# EAGLE design mw_ltb_full_v2.0.0 (EAGLE 6.4)
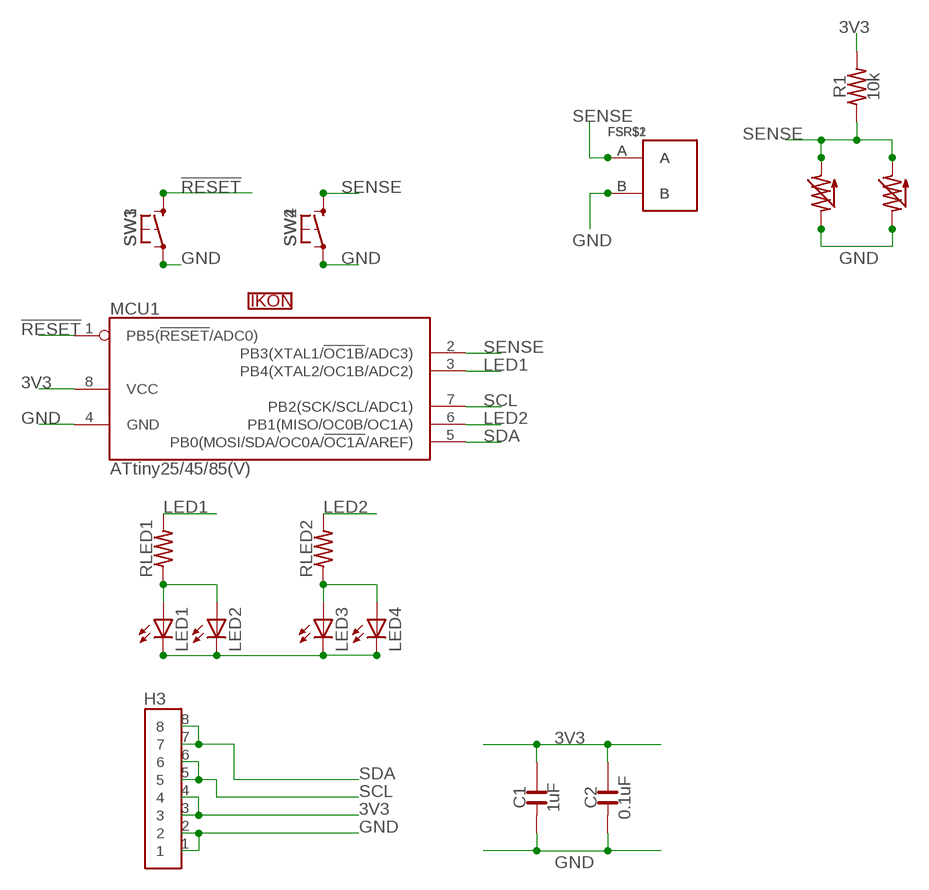
[diagram p0: schematic, sheet 1]

## Parts
C1  1uF  CAPACITOR-0603  [0603_YAGEO]
C2  0.1uF  CAPACITOR-0603  [0603_YAGEO]
FSR$1  FSR_PAD88X44_P2B  [FSR_PAD_88X44_P2B]
FSR$2  FSR_PAD88X44_P2B  [FSR_PAD_88X44_P2B]
H3  HEADER_8P-0.1"_2X4-SMD-SULLINS  [HEADER-0.1"_2X4-SMD-SULLINS]
LED1  LED-ZBEND_RM  [Z-BEND_RM]
LED2  LED-ZBEND_RM  [Z-BEND_RM]
LED3  LED-ZBEND_RM  [Z-BEND_RM]
LED4  LED-ZBEND_RM  [Z-BEND_RM]
MCU1  ATMEL_ATTINY25/45/85(V)-SOIC_DUAL  [SOIC-8_DUAL]
R1  10k  RESISTOR-0603  [0603_YAGEO]
RLED1  RESISTOR-0603  [0603_YAGEO]
RLED2  RESISTOR-0603  [0603_YAGEO]
SW1  SWITCH_SPST-KMT0  [SWITCH_KMT0]
SW2  SWITCH_SPST-KMT0  [SWITCH_KMT0]
SW3  SWITCH_SPST-TL3315  [SWITCH_TL3315]
SW4  SWITCH_SPST-TL3315  [SWITCH_TL3315]
U$1  FSR_PINS  FSR_PINSJUMBO_SMD  [FSR_0.1"-PITCH_PADS-0.05"X0.5"]
U$2  FSR_PLACE  FSR_PLACE1.5"SQR  [FSR_1.5[IN]_SQR]
U$3  FSR_PINS  FSR_PINSJUMBO_SMD  [FSR_0.1"-PITCH_PADS-0.05"X0.5"]
U$4  FSR_PLACE  FSR_PLACE1.5"SQR  [FSR_1.5[IN]_SQR]
U$5  FSR_PLACE  FSR_PLACE1.5"SQR  [FSR_1.5[IN]_SQR]
U$6  FSR_PLACE  FSR_PLACE1.5"SQR  [FSR_1.5[IN]_SQR]
U$9  FSR_PINS  FSR_PINSJUMBO_SMD  [FSR_0.1"-PITCH_PADS-0.05"X0.5"]
U$10  FSR_PINS  FSR_PINSJUMBO_SMD  [FSR_0.1"-PITCH_PADS-0.05"X0.5"]
U$11  IKONLEARNING-20MIL  [IKON_LEARNING_20MIL]

## Nets
3V3: C1.2 C2.2 H3.3 H3.4 MCU1.8(VCC) R1.2
!RESET: MCU1.1(PB5(!RESET!/ADC0)) SW1.1@1 SW1.1@2 SW3.1@1 SW3.1@2
GND: C1.1 C2.1 FSR$1.B FSR$2.B H3.1 H3.2 LED1.K(C) LED2.K(C) LED3.K(C) LED4.K(C) MCU1.4(GND) SW1.2@1 SW1.2@2 SW2.2@1 SW2.2@2 SW3.2@1 SW3.2@2 SW4.2@1 SW4.2@2 U$1.P$1 U$3.P$2 U$9.P$2 U$10.P$1
LED1: MCU1.3(PB4(XTAL2/OC1B/ADC2)) RLED1.2
LED2: MCU1.6(PB1(MISO/OC0B/OC1A)) RLED2.2
N$1: LED1.A LED2.A RLED1.1
N$2: LED3.A LED4.A RLED2.1
SCL: H3.5 H3.6 MCU1.7(PB2(SCK/SCL/ADC1))
SDA: H3.7 H3.8 MCU1.5(PB0(MOSI/SDA/OC0A/!OC1A!/AREF))
SENSE: FSR$1.A FSR$2.A MCU1.2(PB3(XTAL1/!OC1B!/ADC3)) R1.1 SW2.1@1 SW2.1@2 SW4.1@1 SW4.1@2 U$1.P$2 U$3.P$1 U$9.P$1 U$10.P$2

## Library data of the parts
C1 C2 = NaN:CAPACITOR
FSR$1 FSR$2 = NaN:FSR_PAD
H3 = NaN:HEADER_8P
LED1-LED4 = NaN:LED: LEDs
MCU1 = NaN:ATMEL_ATTINY25/45/85(V)
R1 RLED1 RLED2 = NaN:RESISTOR
SW1-SW4 = NaN:SWITCH_SPST
U$1 U$3 U$9 U$10 = NaN:FSR_PINS
U$2 U$4-U$6 = NaN:FSR_PLACE
U$11 = NaN:IKON

## Board
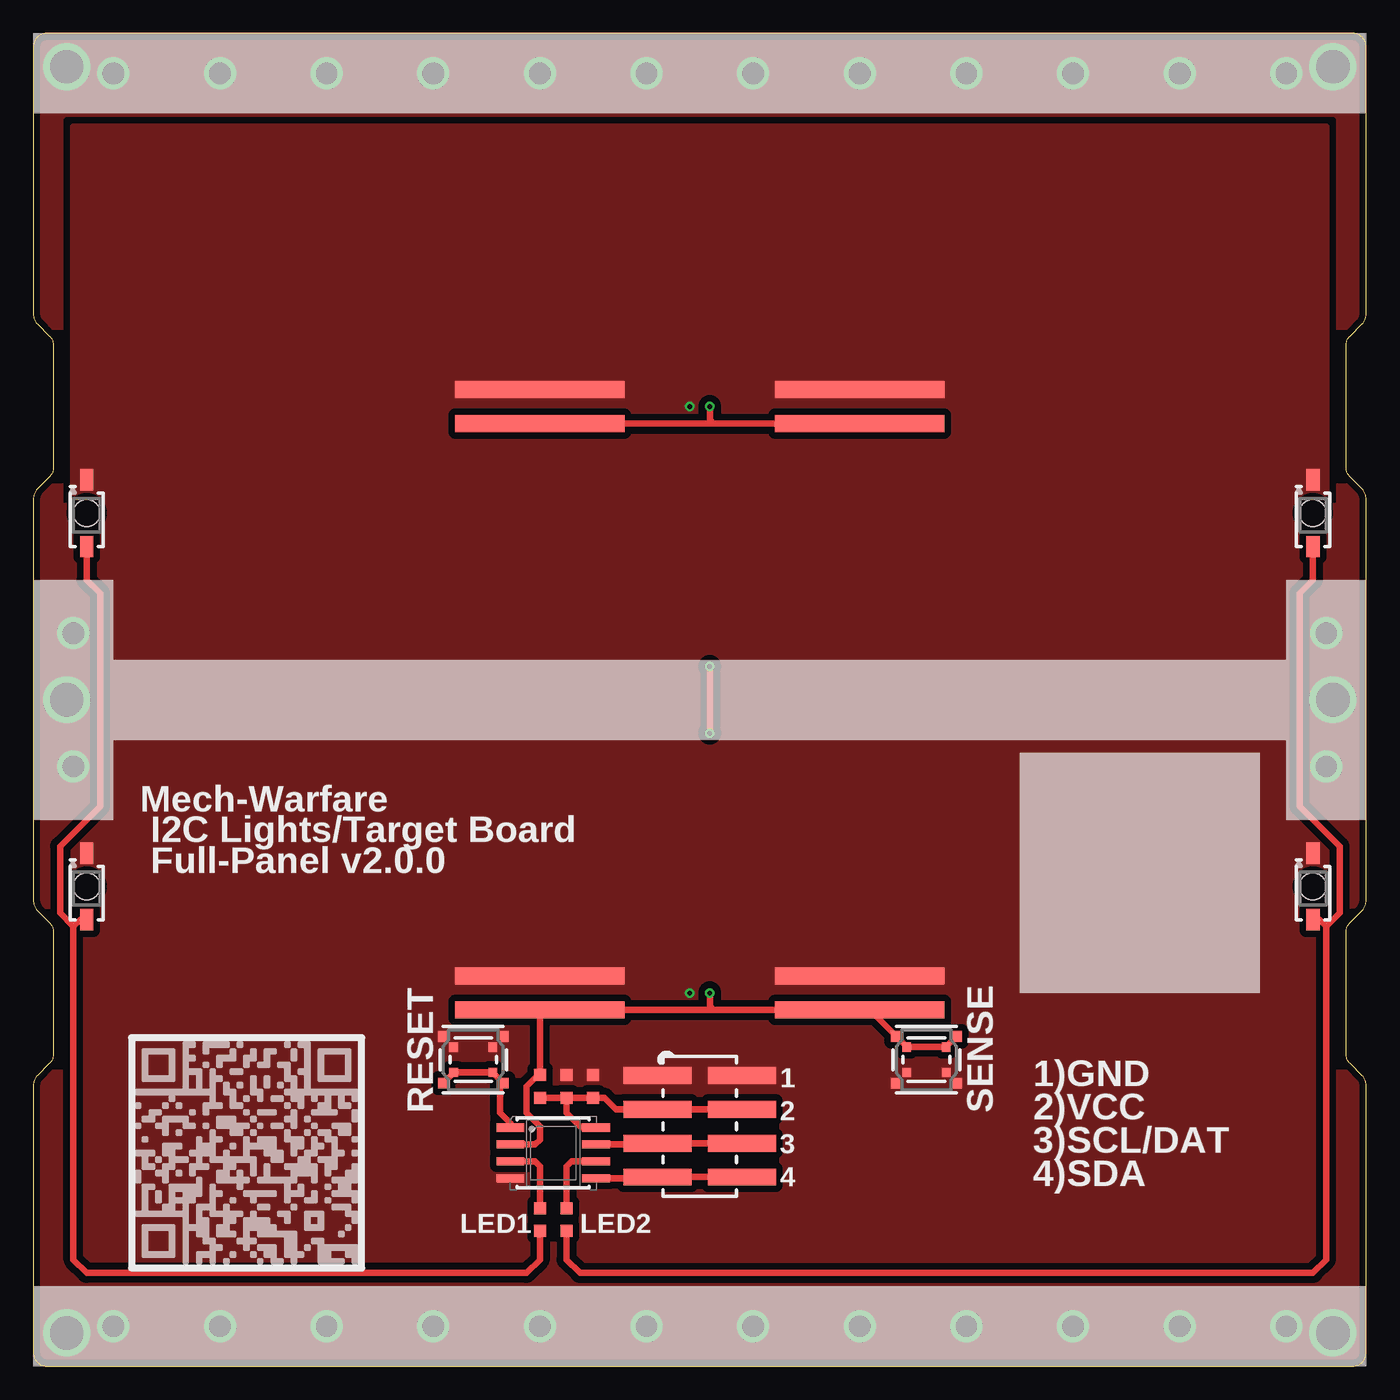
[diagram p1: board, top side]
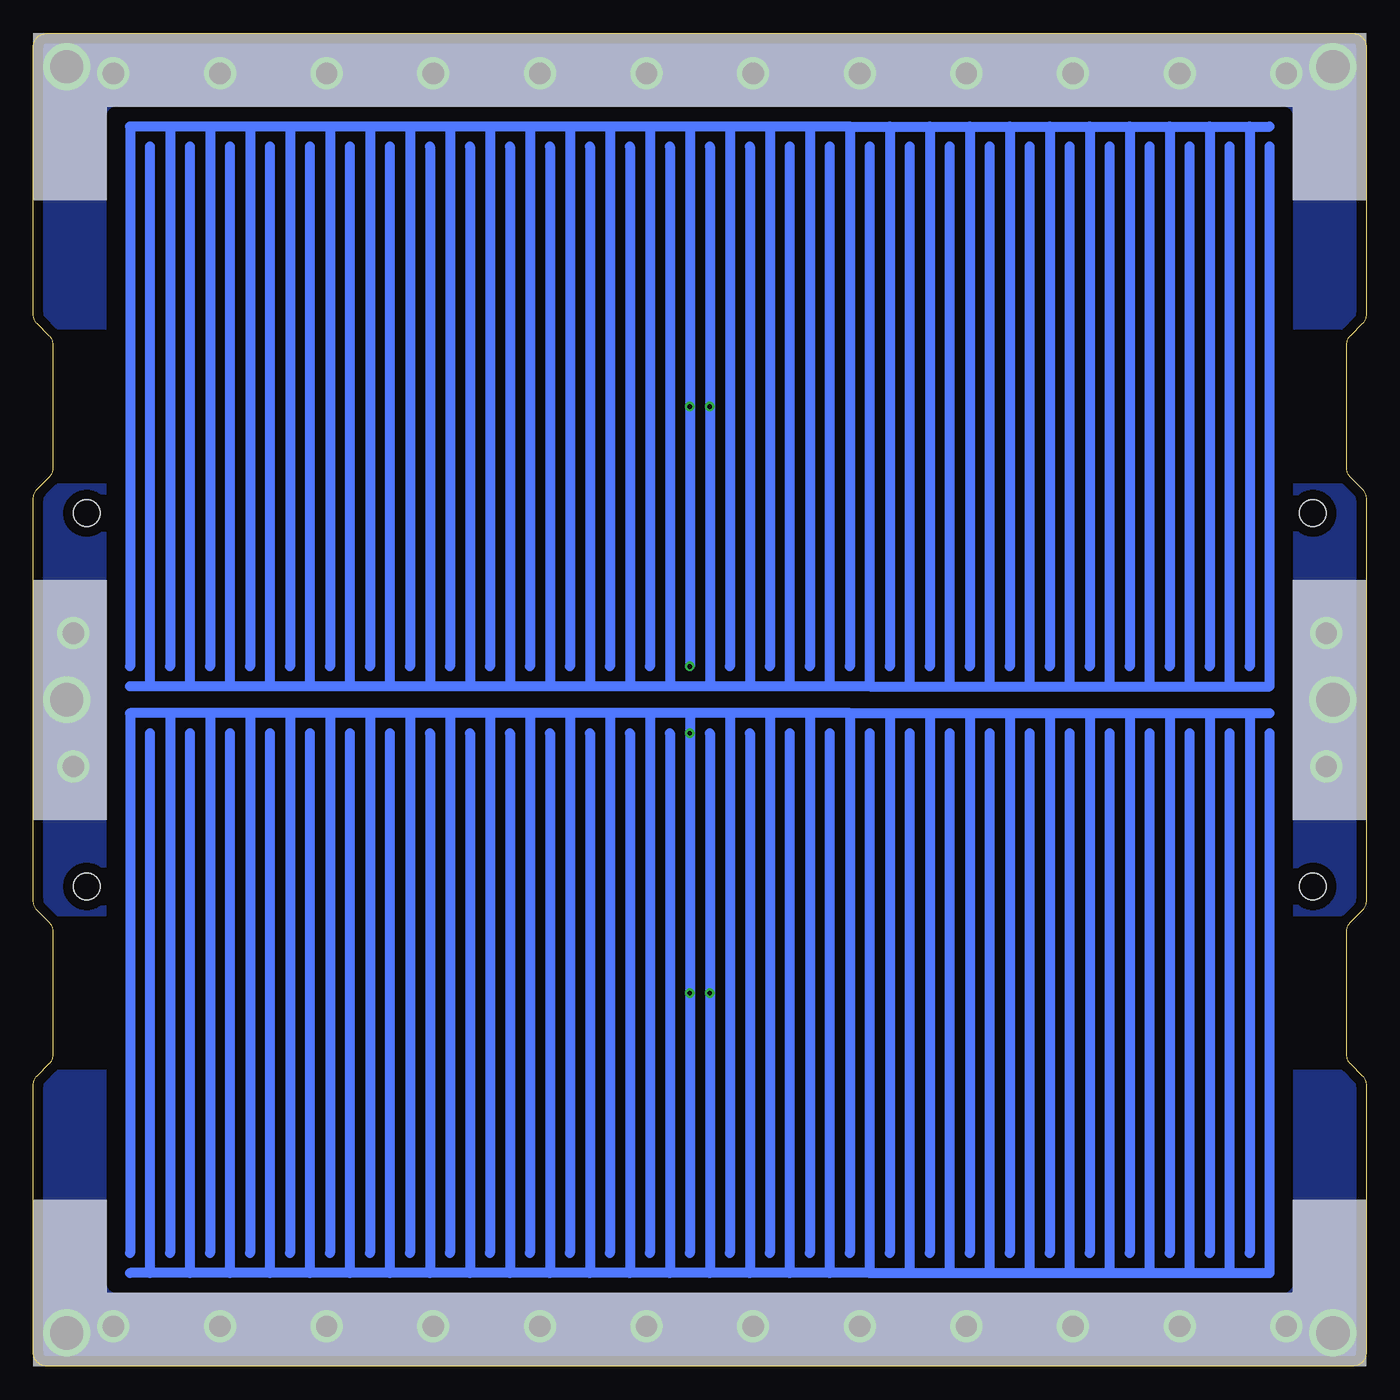
[diagram p2: board, bottom side, seen from below]

Size 100 x 100 mm. Coordinates in mm from the lower left corner, seen from the top.
Outline: 98.5,23.41 98.5,32.59 arc-45 98.79,33.29 99.71,34.21 arc45 100,34.91 100,65.09 arc45 99.71,65.79 98.79,66.71 arc-45 98.5,67.41 98.5,76.59 arc-45 98.79,77.29 99.71,78.21 arc45 100,78.91 100,99 arc90 99,100 1,100 arc90 0,99 0,78.91 arc45 0.29,78.21 1.21,77.29 arc-45 1.5,76.59 1.5,67.41 arc-45 1.21,66.71 0.29,65.79 arc45 0,65.09 0,34.91 arc45 0.29,34.21 1.21,33.29 arc-45 1.5,32.59 1.5,23.41 arc-45 1.21,22.71 0.29,21.79 arc45 0,21.09 0,1 arc90 1,0 99,0 arc90 100,1 100,21.09 arc45 99.71,21.79 98.79,22.71 arc-45 98.5,23.41
Copper layers (1*16): Top 0.0356mm / dielectric 1.5011mm / Bottom 0.0356mm
Design rules "LaenPCBOrder_mod_metric *": minimum track width 0.16mm, minimum drill 0.35mm, track to track 0.16mm, track to pad 0.16mm, pad to pad 0.16mm, via to via 0.16mm, smd to smd 0mil, copper to edge 0.4mm, drill to drill 0.16mm, minimum pad ring 0.18mm, minimum via ring 0.18mm, stop-mask expansion 0.102mm, vias tented up to drill 3mm, thermal gap 10mil

### Footprints (pad centres in the part's own frame; a part is rotated, then mirrored left to right if it is on the bottom)
0603_YAGEO = smd 0.9 x 0.9: 1 0,0.85; 2 0,-0.85
FSR_PAD_88X44_P2B = drill 0.35: A 0.75,0; B -0.75,0
HEADER-0.1"_2X4-SMD-SULLINS = smd 1.27 x 5.08: 1 -3.81,-3.175; 2 -3.81,3.175; 3 -1.27,-3.175; 4 -1.27,3.175; 5 1.27,-3.175; 6 1.27,3.175; 7 3.81,-3.175; 8 3.81,3.175
Z-BEND_RM = smd 1.6 x 1: A -2.5,0; K 2.5,0 | hole 2: 0,0
SOIC-8_DUAL = smd 2.075 x 0.61: 1 -3.212,1.905; 2 -3.212,0.635; 3 -3.212,-0.635; 4 -3.212,-1.905; 5 3.212,-1.905; 6 3.212,-0.635; 7 3.212,0.635; 8 3.212,1.905
SWITCH_KMT0 = smd 0.65 x 0.7: 1@1 -1.475,0.95; 1@2 1.475,0.95; 2@1 -1.475,-0.95; 2@2 1.475,-0.95
SWITCH_TL3315 = smd 0.8 x 0.8: 1@1 -2.25,1.75; 1@2 2.25,1.75; 2@1 -2.25,-1.75; 2@2 2.25,-1.75
FSR_0.1"-PITCH_PADS-0.05"X0.5" = smd 1.27 x 12.7: P$1 -1.27,0; P$2 1.27,0

### Placement (x,y rotation side)
C1  42,21 0 top
C2  40,21 0 top
FSR$1  50,28 0 top
FSR$2  50,72 0 top
H3  50,18 270 top
LED1  4,36 90 top
LED2  4,64 90 top
LED3  96,36 90 top
LED4  96,64 90 top
MCU1  39,16 0 top
R1  38,21 0 top
RLED1  38,11 180 top
RLED2  40,11 180 top
SW1  33,23 180 top
SW2  67,23 0 top
SW3  33,23 180 top
SW4  67,23 0 top
U$1  62,72 270 top
U$2  28,72 90 bottom
U$3  38,72 90 top
U$4  72,72 270 bottom
U$5  28,28 90 bottom
U$6  72,28 270 bottom
U$9  38,28 90 top
U$10  62,28 270 top
U$11  16,16 0 top

### Tracks (layer width: path | path; a pad name or v marks a point on that pad's centre or on a via)
3V3
  Top 0.5: H3.4 H3.3 43.73,19.27 42.85,20.15 C1.2 C2.2 | MCU1.8 41.09,17.91 40,19 C2.2 | C2.2 R1.2
!RESET
  Top 0.5: SW3.1@2 31.52,22.02 SW1.1@2 SW1.1@1 34.48,22.02 SW3.1@1 35,21 35,19 35.79,18.21 MCU1.1
GND
  pour Top (isolate 0.5, rank 2, no thermals): 3,7 3,39 6,42 6,58 3,61 3,93 97,93 97,61 94,58 94,42 97,39 97,7
LED1
  Top 0.5: MCU1.3 37.63,15.37 38,15 RLED1.2
LED2
  Top 0.5: MCU1.6 40.37,15.37 40,15 RLED2.2
N$1
  Top 0.5: RLED1.1 38,8 37,7 4,7 3,8 3,33 | LED2.A 4,59 5,58 5,42 2,39 2,34 3,33 | LED1.A 3.5,33.5 3,33
N$2
  Top 0.5: RLED2.1 40,8 41,7 96,7 97,8 97,33 | LED4.A 96,59 95,58 95,42 98,39 98,34 97,33 | LED3.A 96.5,33.5 97,33
SCL
  Top 0.5: H3.6 H3.5 46.73,16.64 MCU1.7
SCR_GND_B  (via drill 1.6, 2.5)
  other vias: 2.5,2.5 22,3 30,3 38,3 46,3 54,3 62,3 70,3 78,3 97.5,2.5 14,3 86,3 94,3 6,3
  pour Top (isolate 0.5, rank 6, no thermals): 0,0 0,22 100,22 100,0
  pour Bottom (isolate 0.75, rank 6, no thermals): 0,0 0,22 100,22 100,0
SCR_GND_L  (via drill 1.6, 2.5)
  other vias: 3,55 3,45 2.5,50
  pour Top (isolate 0.5, rank 6, no thermals): 0,66 9,66 9,34 0,34
  pour Bottom (isolate 0.75, rank 6, no thermals): 0,66 9,66 9,34 0,34
SCR_GND_R  (via drill 1.6, 2.5)
  other vias: 97,45 97,55 97.5,50
  pour Top (isolate 0.5, rank 6, no thermals): 100,66 91,66 91,34 100,34
  pour Bottom (isolate 0.75, rank 6, no thermals): 100,66 91,66 91,34 100,34
SCR_GND_T  (via drill 1.6, 2.5)
  other vias: 2.5,97.5 22,97 30,97 38,97 46,97 54,97 62,97 70,97 78,97 97.5,97.5 86,97 14,97 6,97 94,97
  pour Bottom (isolate 0.75, rank 6, no thermals): 0,78 0,100 100,100 100,78
  pour Top (isolate 0.5, rank 6, no thermals): 0,78 0,100 100,100 100,78
SDA
  Top 0.5: H3.8 H3.7 46.73,14.1 MCU1.5
SENSE  (via drill 0.35)
  Top 0.5: 51,26.73 U$9.P$1 R1.1 37.85,21.85 37,21 37,19 38,18 38,17 37.63,16.64 MCU1.2 | 51,26.73 U$10.P$2 62.77,26.73 SW4.1@1 65.53,23.98 SW2.1@1 SW2.1@2 68.47,23.98 SW4.1@2 | FSR$1.A 50.75,26.98 51,26.73 | v50.75,52.5 v50.75,47.5 | U$3.P$1 51,70.73 | 51,70.73 U$1.P$2 | FSR$2.A 50.75,70.98 51,70.73
  Bottom 0.5: FSR$2.A v50.75,52.5 | v50.75,47.5 FSR$1.A

### Text on the board
tPlace: Mech-Warfare / I2C Lights/Target Board / Full-Panel v2.0.0 | 1)GND | RESET | SENSE | 2)VCC | 3)SCL/DAT | 1 / 2 / 3 / 4 | 4)SDA | LED1 | LED2